# EAGLE design LOCO-Servo (EAGLE 9.5.2)

## Sheet 1 of 2
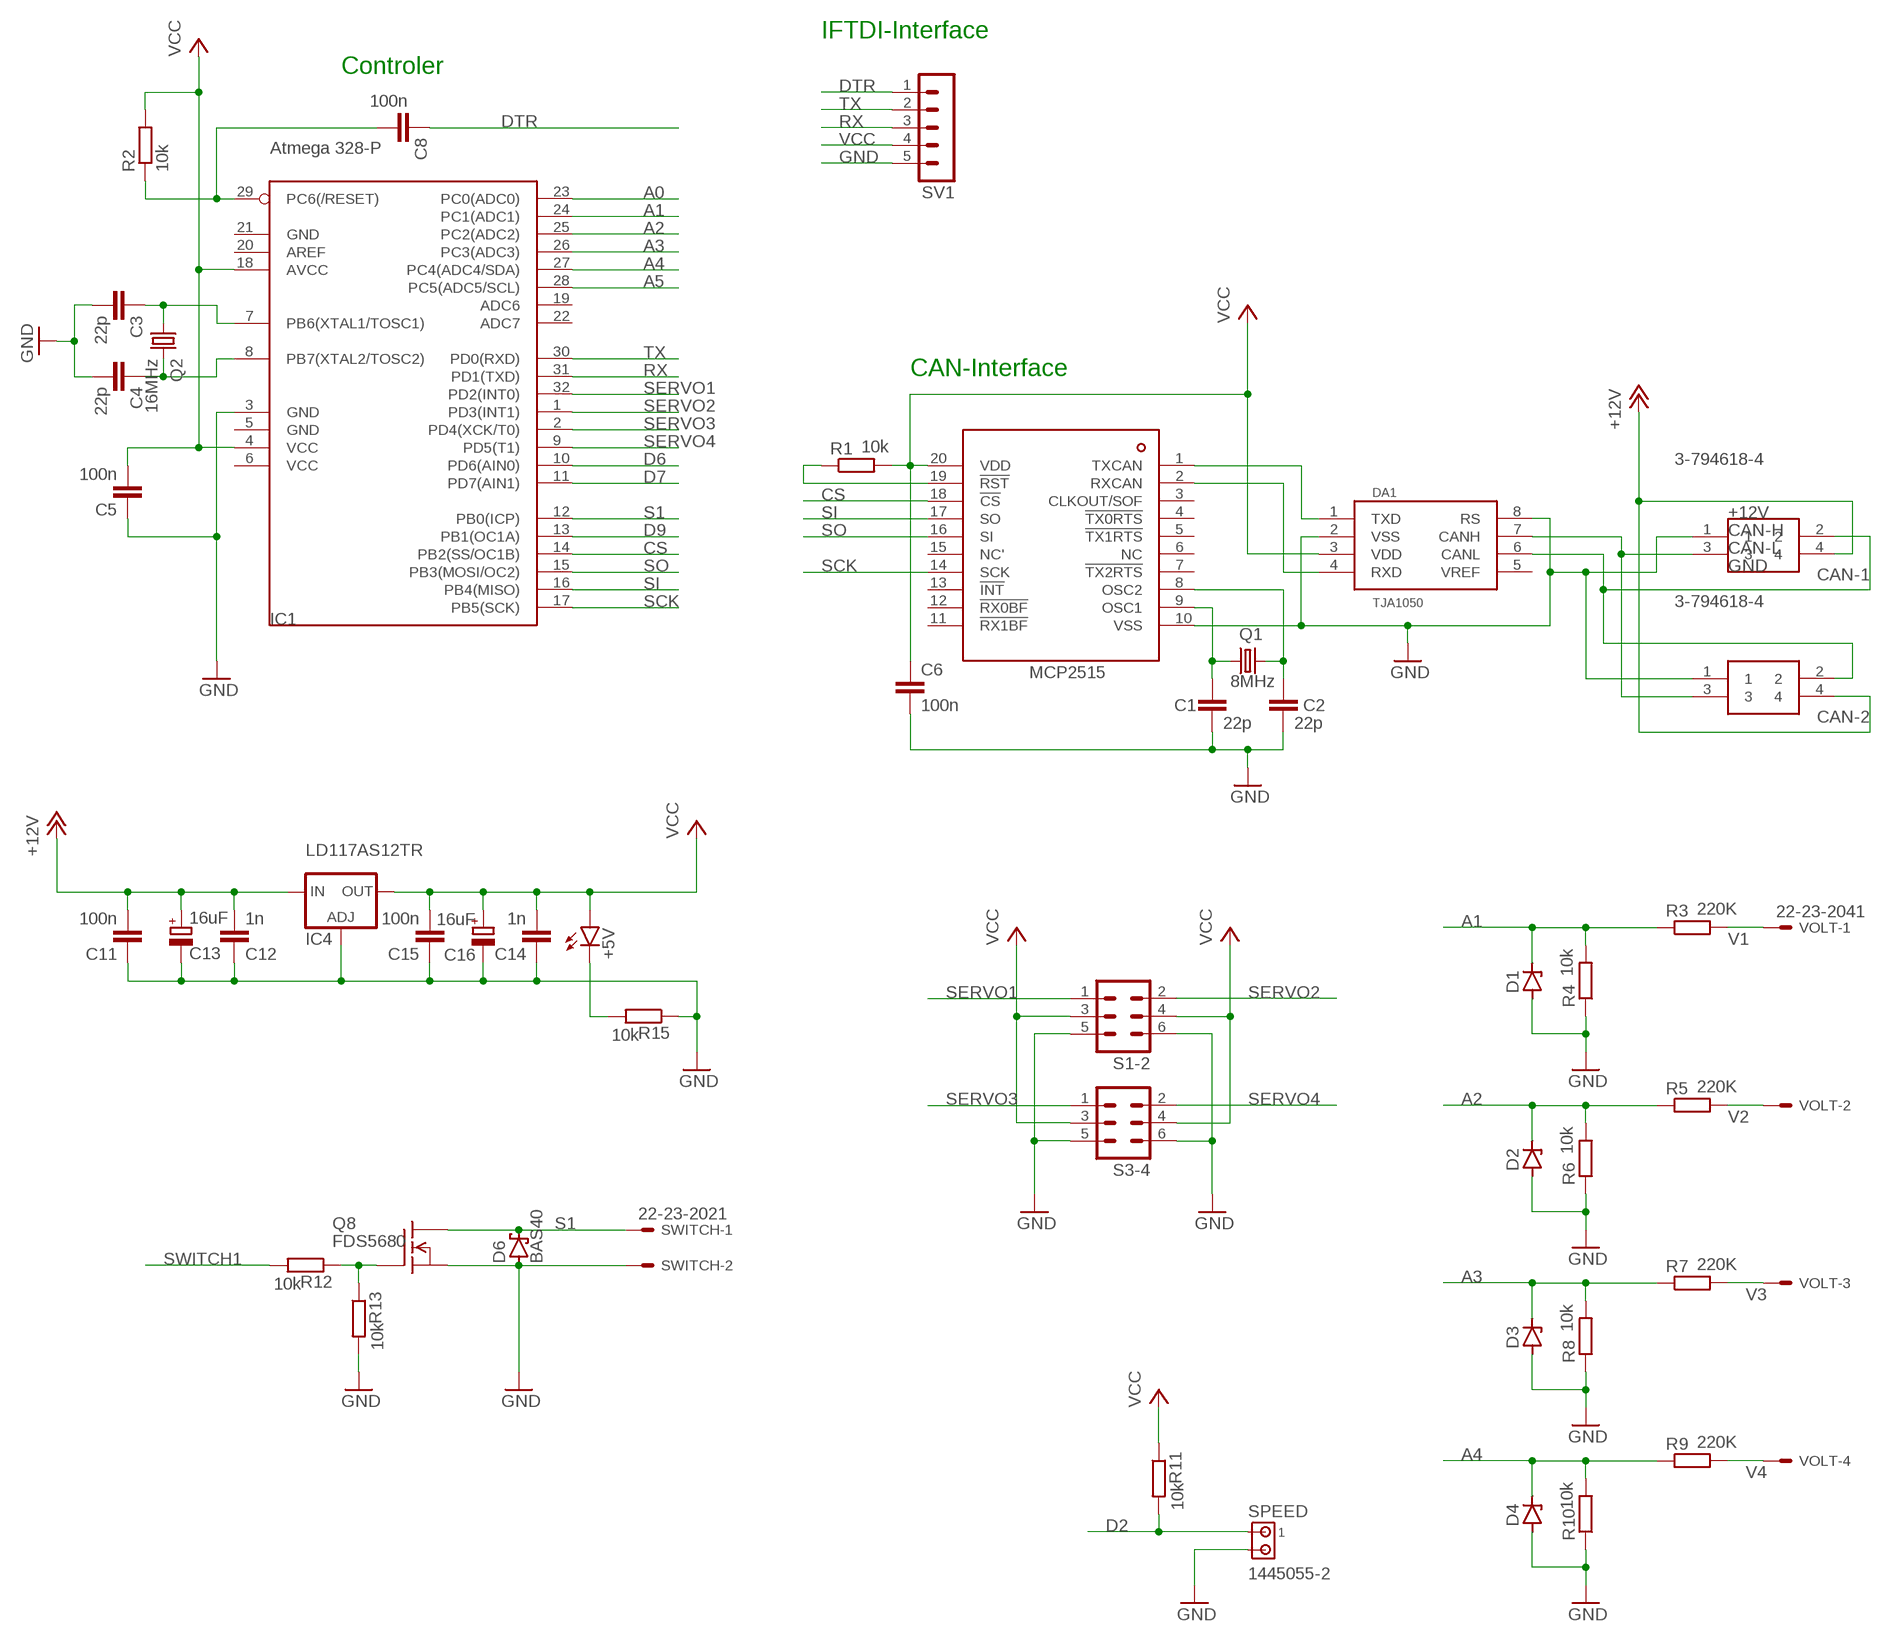
[diagram p0: schematic, sheet 1]

### Parts
+5V  LEDCHIP-LED0603  [CHIP-LED0603]
C1  22p  C-EUC0402K  [C0402K]
C2  22p  C-EUC0402K  [C0402K]
C3  22p  C-EUC0402K  [C0402K]
C4  22p  C-EUC0402K  [C0402K]
C5  100n  C-EUC0402K  [C0402K]
C6  100n  C-EUC0402K  [C0402K]
C8  100n  C-EUC0402K  [C0402K]
C11  100n  C-EUC0402K  [C0402K]
C12  1n  C-EUC0402K  [C0402K]
C13  16uF  CPOL-EUA/3216-18W  [A/3216-18W]
C14  1n  C-EUC0402K  [C0402K]
C15  100n  C-EUC0402K  [C0402K]
C16  16uF  CPOL-EUA/3216-18W  [A/3216-18W]
CAN-1  3-794618-4  [SHDRRA4W102P300_2X2_686X892X73]
CAN-2  3-794618-4  [SHDRRA4W102P300_2X2_686X892X73]
D1  ZENER-DIODESOD80C  [SOD80C]
D2  ZENER-DIODESOD80C  [SOD80C]
D3  ZENER-DIODESOD80C  [SOD80C]
D4  ZENER-DIODESOD80C  [SOD80C]
D6  BAS40  [SOT23]
DA1  TJA1050  [SO08]
IC1  Atmega 328-P  MEGA8-AI  [TQFP32-08]
IC2  MCP2515  [TSSOP20]
IC4  LD117AS12TR  [SOT223]
Q1  8MHz  CRYSTALHC49S  [HC49/S]
Q2  16MHz  CRYSTALHC49S  [HC49/S]
Q8  FDS5680  [SO-8]
R1  10k  R-EU_MELF0102W  [MINI_MELF-0102W]
R2  10k  R-EU_MELF0102W  [MINI_MELF-0102W]
R3  220K  R-EU_MELF0102W  [MINI_MELF-0102W]
R4  10k  R-EU_MELF0102W  [MINI_MELF-0102W]
R5  220K  R-EU_MELF0102W  [MINI_MELF-0102W]
R6  10k  R-EU_MELF0102W  [MINI_MELF-0102W]
R7  220K  R-EU_MELF0102W  [MINI_MELF-0102W]
R8  10k  R-EU_MELF0102W  [MINI_MELF-0102W]
R9  220K  R-EU_MELF0102W  [MINI_MELF-0102W]
R10  10k  R-EU_MELF0102W  [MINI_MELF-0102W]
R11  10k  R-EU_MELF0102W  [MINI_MELF-0102W]
R12  10k  R-EU_MELF0102W  [MINI_MELF-0102W]
R13  10k  R-EU_MELF0102W  [MINI_MELF-0102W]
R15  10k  R-EU_MELF0102W  [MINI_MELF-0102W]
S1-2  MA03-2  [MA03-2]
S3-4  MA03-2  [MA03-2]
SPEED  1445055-2  [1445055-2]
SV1  MA05-1  [MA05-1]
SWITCH  22-23-2021  [22-23-2021]
VOLT  22-23-2041  [22-23-2041]

### Nets
+12V: C11.2 C12.2 C13.+ CAN-1.4 CAN-2.4 IC4.3(IN)
A0: IC1.23(PC0(ADC0))
A1: D1.C IC1.24(PC1(ADC1)) R3.1 R4.2
A2: D2.C IC1.25(PC2(ADC2)) R5.1 R6.2
A3: D3.C IC1.26(PC3(ADC3)) R7.1 R8.2
A4: D4.C IC1.27(PC4(ADC4/SDA)) R9.1 R10.2
A5: IC1.28(PC5(ADC5/SCL))
CAN-H: CAN-1.3 CAN-2.3 DA1.7(CANH)
CAN-L: CAN-1.2 CAN-2.2 DA1.6(CANL)
CAN-OCC1: C1.1 IC2.9(OSC1) Q1.1
CAN-OCC2: C2.1 IC2.8(OSC2) Q1.2
CS: IC1.14(PB2(SS/OC1B)) IC2.18(!CS)
D2: R11.2 SPEED.1
D6: IC1.10(PD6(AIN0))
D7: IC1.11(PD7(AIN1))
D9: IC1.13(PB1(OC1A))
DTR: C8.1 SV1.1
GND: C1.2 C2.2 C3.2 C4.2 C5.1 C6.2 C11.1 C12.1 C13.- C14.1 C15.1 C16.- CAN-1.1 CAN-2.1 D1.A D2.A D3.A D4.A D6.1(A) DA1.2(VSS) DA1.8(RS) IC1.3(GND) IC2.10(VSS) IC4.1(ADJ) Q8.1(S) Q8.2(S) Q8.3(S) R4.1 R6.1 R8.1 R10.1 R13.2 R15.1 S1-2.5 S1-2.6 S3-4.5 S3-4.6 SPEED.2 SV1.5 SWITCH.2
N$6: IC2.19(!RST) R1.1
N$8: Q8.4(G) R12.1 R13.1
N$10: C3.1 IC1.7(PB6(XTAL1/TOSC1)) Q2.1
N$11: C4.1 IC1.8(PB7(XTAL2/TOSC2)) Q2.2
N$12: +5V.C R15.2
N$15: C8.2 IC1.29(PC6(/RESET)) R2.1
RX: IC1.31(PD1(TXD)) SV1.3
RXCAN: DA1.4(RXD) IC2.2(RXCAN)
S1: D6.3(C) IC1.12(PB0(ICP)) Q8.5(D) Q8.6(D) Q8.7(D) Q8.8(D) SWITCH.1
SCK: IC1.17(PB5(SCK)) IC2.14(SCK)
SERVO1: IC1.32(PD2(INT0)) S1-2.1
SERVO2: IC1.1(PD3(INT1)) S1-2.2
SERVO3: IC1.2(PD4(XCK/T0)) S3-4.1
SERVO4: IC1.9(PD5(T1)) S3-4.2
SI: IC1.16(PB4(MISO)) IC2.17(SO)
SO: IC1.15(PB3(MOSI/OC2)) IC2.16(SI)
SWITCH1: R12.2
TX: IC1.30(PD0(RXD)) SV1.2
TXCAN: DA1.1(TXD) IC2.1(TXCAN)
V1: R3.2 VOLT.1
V2: R5.2 VOLT.2
V3: R7.2 VOLT.3
V4: R9.2 VOLT.4
VCC: +5V.A C5.2 C6.1 C14.2 C15.2 C16.+ DA1.3(VDD) IC1.4(VCC) IC1.18(AVCC) IC2.20(VDD) IC4.4(OUT) R1.2 R2.2 R11.1 S1-2.3 S1-2.4 S3-4.3 S3-4.4 SV1.4
Unconnected: DA1.5(VREF) IC1.19(ADC6) IC1.20(AREF) IC1.22(ADC7) IC2.3(CLKOUT/SOF) IC2.4(!TX0RTS) IC2.5(!TX1RTS) IC2.6(NC) IC2.7(!TX2RTS) IC2.11(!RX1BF) IC2.12(!RX0BF) IC2.13(!INT) IC2.15(NC')

### Notes on the sheet
- IFTDI-Interface
- Controler
- CAN-Interface

## Sheet 2 of 2

## Power pins joined to a net without a drawn wire
GND: IC1.5(GND) IC1.21(GND)
VCC: IC1.6(VCC)

## Library data of the parts
+5V = led:LED: LED OSRAM: - CHIPLED LG R971, LG N971, LY N971, LG Q971, LY Q971, LO R971, LY R971 LH N974, LH R974 LS Q976, LO Q976, LY Q976 LO Q996 - Hyper CHIPLED LW Q18S LB Q993, LB Q99A, LB R99A - SideLED LS A670, LO A670, LY A670, LG A670, LP A670 LB A673, LV A673, LT A673, LW A673 LH A674 LY A675 LS A676, LA A676, LO A676, LY A676, LW A676 LS A679, LY A679, LG A679 - Hyper Micro SIDELED® LS Y876, LA Y876, LO Y876, LY Y876 LT Y87S - SmartLED LW L88C, LW L88S LB L89C, LB L89S, LG L890 LS L89K, LO L89K, LY L89K LS L896, LA L896, LO L896, LY L896 - TOPLED LS T670, LO T670, LY T670, LG T670, LP T670 LSG T670, LSP T670, LSY T670, LOP T670, LYG T670 LG T671, LOG T671, LSG T671 LB T673, LV T673, LT T673, LW T673 LH T674 LS T676, LA T676, LO T676, LY T676, LB T676, LH T676, LSB T676, LW T676 LB T67C, LV T67C, LT T67C, LS T67K, LO T67K, LY T67K, LW E67C LS E67B, LA E67B, LO E67B, LY E67B, LB E67C, LV E67C, LT E67C LW T67C LS T679, LY T679, LG T679 LS T770, LO T770, LY T770, LG T770, LP T770 LB T773, LV T773, LT T773, LW T773 LH T774 LS E675, LA E675, LY E675, LS T675 LS T776, LA T776, LO T776, LY T776, LB T776 LHGB T686 LT T68C, LB T68C - Hyper Mini TOPLED® LB M676 - Mini TOPLED Santana® LG M470 LS M47K, LO M47K, LY M47K Source: http://www.osram.convergy.de LUXEON: - LUMILED® LXK2-PW12-R00, LXK2-PW12-S00, LXK2-PW14-U00, LXK2-PW14-V00 LXK2-PM12-R00, LXK2-PM12-S00, LXK2-PM14-U00 LXK2-PE12-Q00, LXK2-PE12-R00, LXK2-PE12-S00, LXK2-PE14-T00, LXK2-PE14-U00 LXK2-PB12-K00, LXK2-PB12-L00, LXK2-PB12-M00, LXK2-PB14-N00, LXK2-PB14-P00, LXK2-PB14-Q00 LXK2-PR12-L00, LXK2-PR12-M00, LXK2-PR14-Q00, LXK2-PR14-R00 LXK2-PD12-Q00, LXK2-PD12-R00, LXK2-PD12-S00 LXK2-PH12-R00, LXK2-PH12-S00 LXK2-PL12-P00, LXK2-PL12-Q00, LXK2-PL12-R00 Source: www.luxeon.com KINGBRIGHT: KA-3528ASYC Source: www.kingbright.com
C1-C6 C8 C11 C12 C14 C15 = rcl:C-EU: CAPACITOR, European symbol; SPICEPREFIX: C
C13 C16 = rcl:CPOL-EU: POLARIZED CAPACITOR, European symbol; SPICEPREFIX: C
CAN-1 CAN-2 = SamacSys_Parts:3-794618-4: 4 way 2 row r/a header Mate-N-Lok Source: Datasheet <https://rs.componentsearchengine.com/Datasheets/2/3-794618-4.pdf>; DESCRIPTION: 4 way 2 row r/a header Mate-N-Lok; HEIGHT: 7.37mm; MANUFACTURER_NAME: TE Connectivity; MANUFACTURER_PART_NUMBER: 3-794618-4
D1-D4 = diode:ZENER-DIODE: Z-Diode
D6 = diode:BAS40: Silicon Schottky Diodes General-purpose diode for high-speed switching
DA1 = TJA1050:TJA1050: High speed CAN transceiver Input levels compatible with 3.3 V and 5 V devices 5V supply
IC1 = atmel:MEGA8: MICROCONTROLLER 8 Kbytes FLASH, 1 kbytes SRAM, 512 bytes EEPROM, USART, 6-channel 10 bit ADC, 2-channel 8 bit ADC Pin compatible with Atmega48, ATMega88, ATMega168 Source: avr.lbr; MPN: ATMEGA8-16AU; OC_FARNELL: 9171371; OC_NEWARK: 73M8863
IC2 = mcp2514:MCP2515: Microchip Technology’s MCP2515 is a stand-alone Controller Area Network (CAN) controller that implements the CAN specification, version 2.0B. It is capable of transmitting and receiving both standard and extended data and remote frames. The MCP2515 has two acceptance masks and six acceptance filters that are used to filter out unwanted messages, thereby reducing the host MCUs overhead. The MCP2515 interfaces with microcontrollers (MCUs) via an industry standard Serial Peripheral Interface (SPI).
IC4 = v-reg:LD117A?*: Low drop fixed and adjustable positive voltage regulators 1 A Source: http://www.st.com/stonline/products/literature/ds/7194/ld1117axx.pdf
Q1 Q2 = crystal:CRYSTAL: CRYSTAL; OC_FARNELL: 1667008; OC_NEWARK: unknown
Q8 = transistor-fet:FDS5680: 60V N-Channel PowerTrench TM MOSFET FAIRCHILD FDS5680.pdf
R1-R13 R15 = rcl:R-EU_: RESISTOR, European symbol; SPICEPREFIX: R
S1-2 S3-4 = con-lstb:MA03-2: PIN HEADER; OC_FARNELL: unknown; OC_NEWARK: unknown
SPEED = con-amp:1445055-2: Micro MATE-N-LOK Connectors grid 1.5 mm Source: ENG_CD_1445055_A.pdf
SV1 = con-lstb:MA05-1: PIN HEADER; OC_FARNELL: unknown; OC_NEWARK: unknown
SWITCH = con-molex:22-23-2021: .100" (2.54mm) Center Header - 2 Pin; MF: MOLEX; MPN: 22-23-2021; OC_FARNELL: 1462926; OC_NEWARK: 25C3832
VOLT = con-molex:22-23-2041: .100" (2.54mm) Center Header - 4 Pin; MF: MOLEX; MPN: 22-23-2041; OC_FARNELL: 1462920; OC_NEWARK: 38C0355

## Board
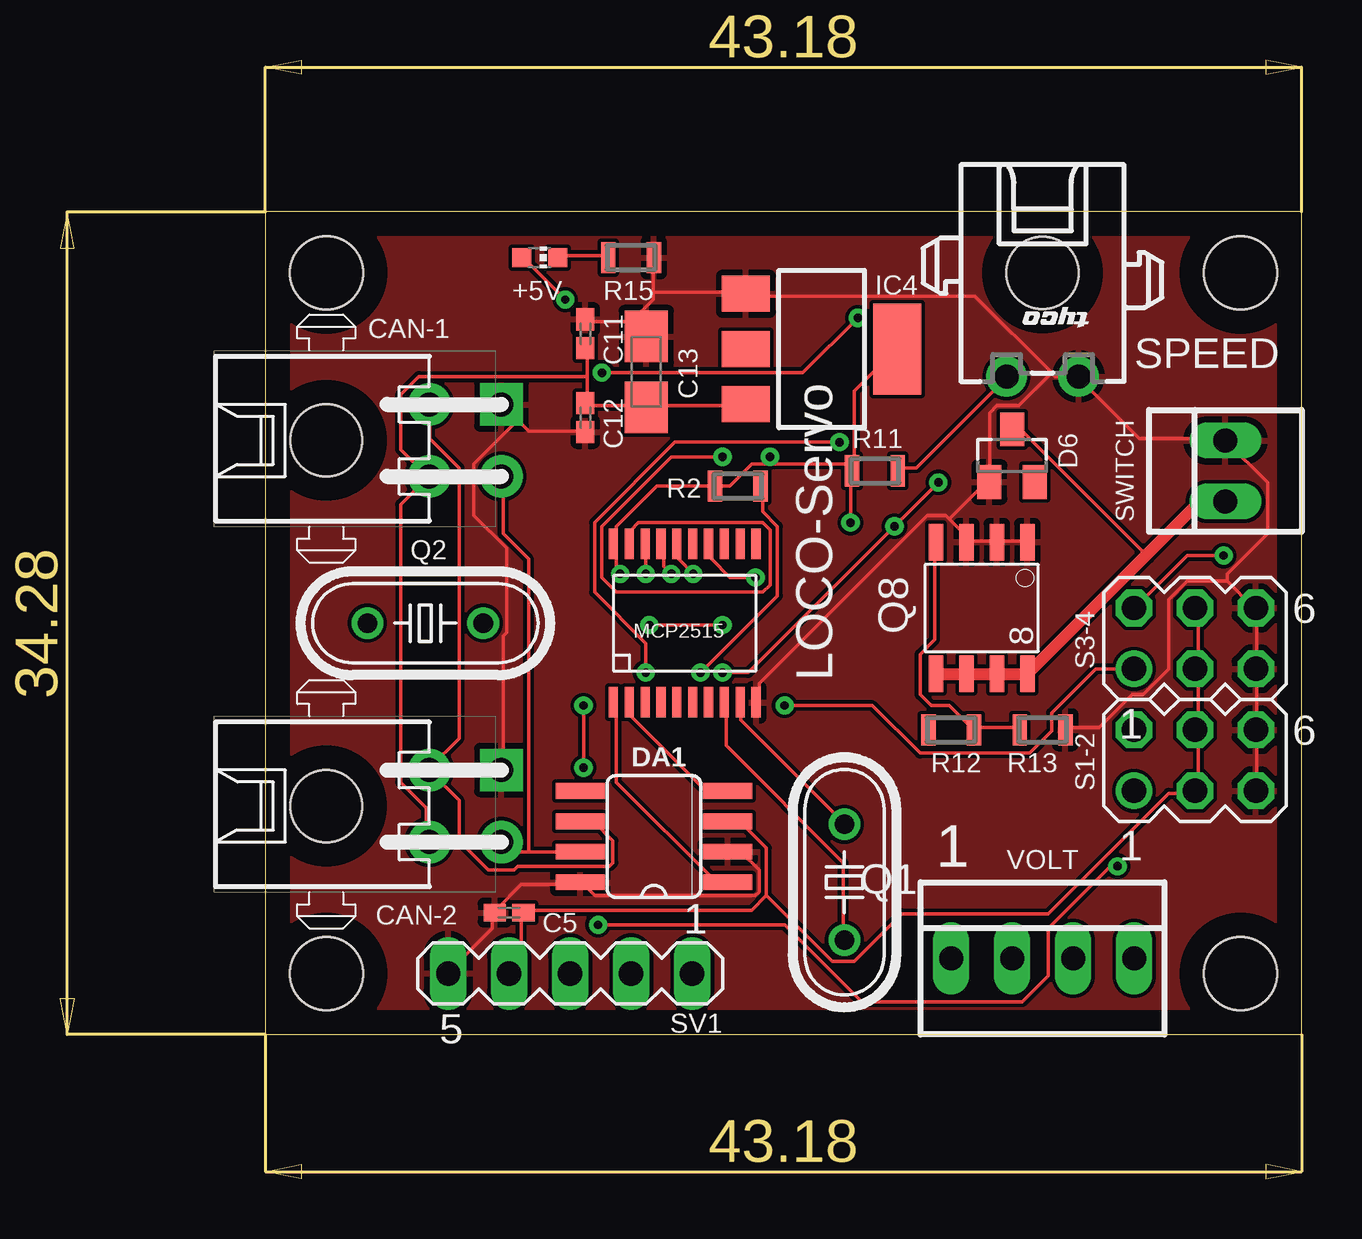
[diagram p1: board, top side]
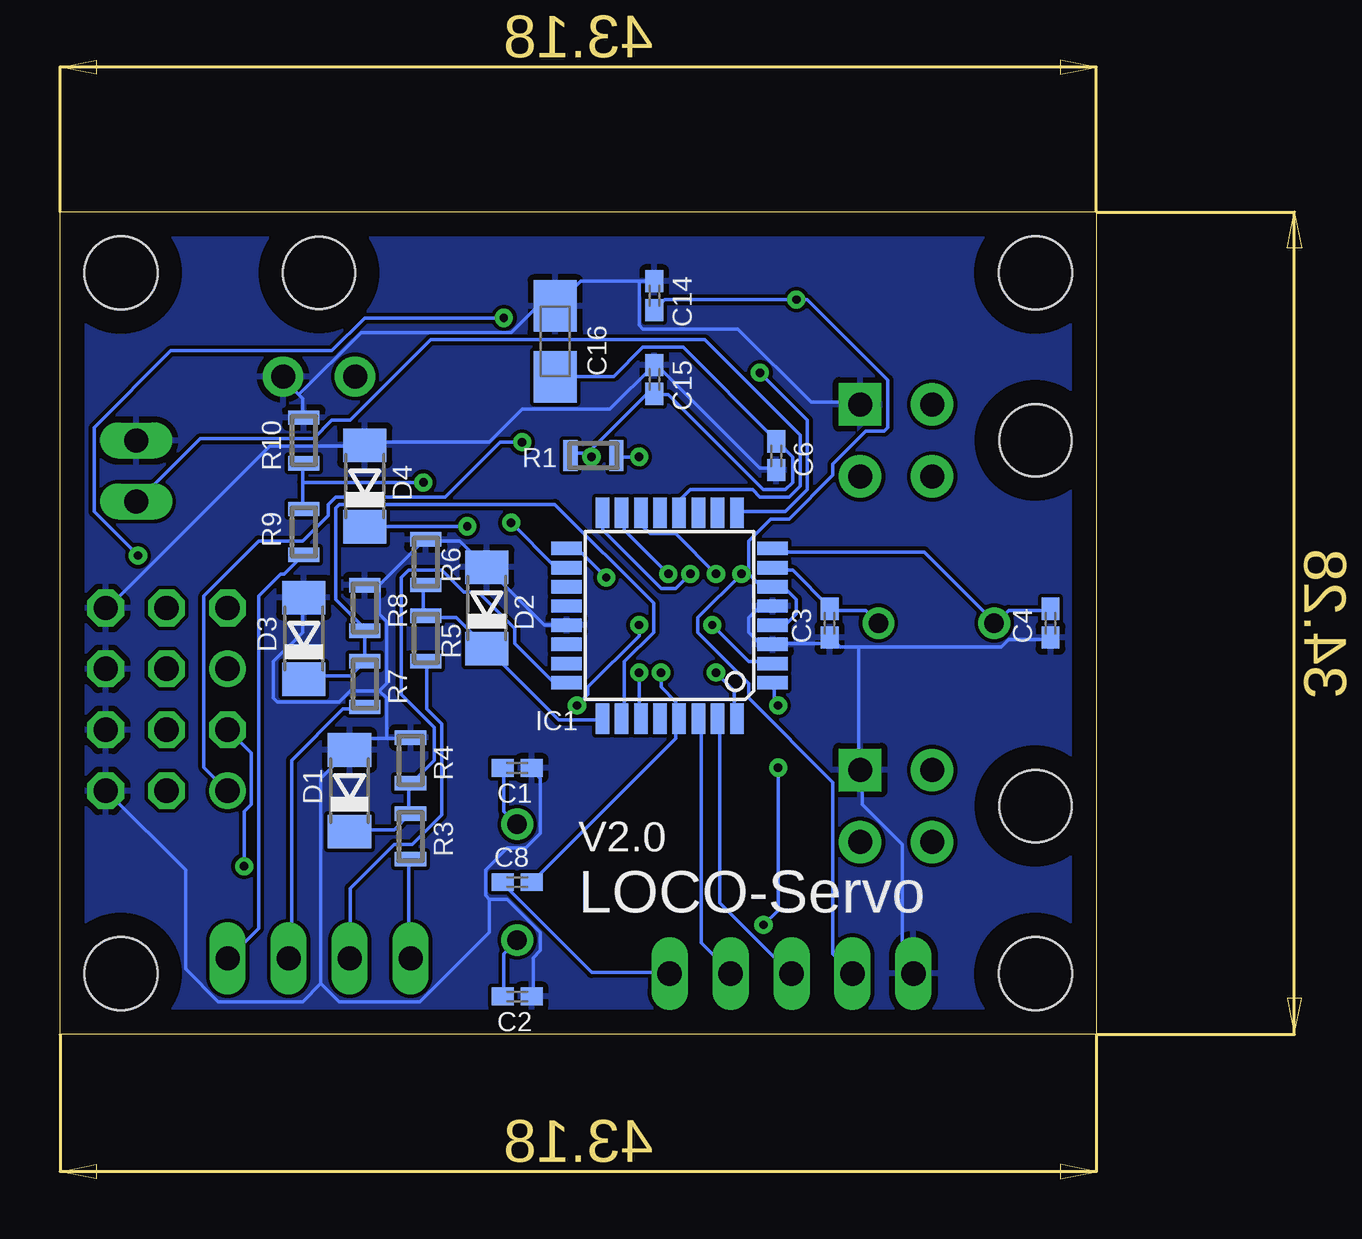
[diagram p2: board, bottom side, seen from below]

Size 43.18 x 34.29 mm. Coordinates in mm from the lower left corner, seen from the top.
Outline: 0,0 43.18,0 43.18,34.29 0,34.29 0,0
Copper layers (1*16): Top 0.035mm / dielectric 1.5mm / Bottom 0.035mm
Design rules "default": minimum track width 6mil, minimum drill 0.35mm, track to track 6mil, track to pad 6mil, pad to pad 6mil, via to via 6mil, smd to smd 6mil, copper to edge 40mil, drill to drill 6mil, minimum pad ring 10mil, minimum via ring 8mil, stop-mask expansion 4mil, vias tented up to drill 0mil, thermal gap 10mil
Holes 3.05 mm at 2.54,2.54 2.54,31.75 40.64,2.54 40.64,31.75

### Footprints (pad centres in the part's own frame; a part is rotated, then mirrored left to right if it is on the bottom)
CHIP-LED0603 = smd 0.8 x 0.8: A 0,-0.75; C 0,0.75
C0402K = smd 0.925 x 0.74: 1 -0.6,0; 2 0.6,0
A/3216-18W = smd 2.15 x 1.8: + 1.475,0; - -1.475,0
SHDRRA4W102P300_2X2_686X892X73 = drill 1 pad 1.778 square: 1 1.5,-7.3 | drill 1 pad 1.778: 2 1.5,-4.3; 3 -1.5,-7.3; 4 -1.5,-4.3 | hole 3: 0,0
SOD80C = smd 1.4 x 1.8: A 1.7,0; C -1.7,0
SOT23 = smd 1 x 1.4: 1 -0.95,-1.1; 2 0.95,-1.1; 3 0,1.1
SO08 = smd 0.66 x 2.032: 1 -1.905,-3.073; 2 -0.635,-3.073; 3 0.635,-3.073; 4 1.905,-3.073; 5 1.905,3.073; 6 0.635,3.073; 7 -0.635,3.073; 8 -1.905,3.073
TQFP32-08 = smd 1.27 x 0.559: 1 -4.293,2.8; 2 -4.293,2; 3 -4.293,1.2; 4 -4.293,0.4; 5 -4.293,-0.4; 6 -4.293,-1.2; 7 -4.293,-2; 8 -4.293,-2.8; 17 4.293,-2.8; 18 4.293,-2; 19 4.293,-1.2; 20 4.293,-0.4; 21 4.293,0.4; 22 4.293,1.2; 23 4.293,2; 24 4.293,2.8 | smd 0.559 x 1.27: 9 -2.8,-4.293; 10 -2,-4.293; 11 -1.2,-4.293; 12 -0.4,-4.293; 13 0.4,-4.293; 14 1.2,-4.293; 15 2,-4.293; 16 2.8,-4.293; 25 2.8,4.293; 26 2,4.293; 27 1.2,4.293; 28 0.4,4.293; 29 -0.4,4.293; 30 -1.2,4.293; 31 -2,4.293; 32 -2.8,4.293
TSSOP20 = smd 1.27 x 0.381: 1 -3.302,2.642; 2 -3.302,1.981; 3 -3.302,1.321; 4 -3.302,0.66; 5 -3.302,0; 6 -3.302,-0.66; 7 -3.302,-1.321; 8 -3.302,-1.981; 9 -3.302,-2.642; 10 -3.302,-3.302; 11 3.302,-3.302; 12 3.302,-2.642; 13 3.302,-1.981; 14 3.302,-1.321; 15 3.302,-0.66; 16 3.302,0; 17 3.302,0.66; 18 3.302,1.321; 19 3.302,1.981; 20 3.302,2.642
SOT223 = smd 1.5 x 2: 1 -2.3,-3.15; 2 0,-3.15; 3 2.3,-3.15 | smd 3.8 x 2: 4 0,3.15
HC49/S = drill 0.813: 1 -2.413,0; 2 2.413,0
SO-8 = smd 1.524 x 0.61: 1 -2.743,1.905; 2 -2.743,0.635; 3 -2.743,-0.635; 4 -2.743,-1.905; 5 2.743,-1.905; 6 2.743,-0.635; 7 2.743,0.635; 8 2.743,1.905
MINI_MELF-0102W = smd 0.6 x 1.3: 1 -0.95,0; 2 0.95,0
MA03-2 = drill 1.016: 1 -2.54,-1.27 | drill 1.016 octagon: 2 -2.54,1.27; 3 0,-1.27; 4 0,1.27; 5 2.54,-1.27; 6 2.54,1.27
1445055-2 = drill 1 pad 1.676: 1 1.5,4.32; 2 -1.5,4.32 | hole 3: 0,0
MA05-1 = drill 1.016 long: 1 -5.08,0; 2 -2.54,0; 3 0,0; 4 2.54,0; 5 5.08,0
22-23-2021 = drill 1 long: 1 -1.27,0; 2 1.27,0
22-23-2041 = drill 1 long: 1 -3.81,0; 2 -1.27,0; 3 1.27,0; 4 3.81,0

### Placement (x,y rotation side)
+5V  11.43,32.38 270 top
C1  24.13,11.11 0 bottom
C2  24.13,1.59 0 bottom
C3  11.11,17.14 270 bottom
C4  1.91,17.14 270 bottom
C5  10.16,5.08 0 top
C6  13.34,24.13 270 bottom
C8  24.13,6.35 0 bottom
C11  13.34,29.21 270 top
C12  13.34,25.72 90 top
C13  15.88,27.62 270 top
C14  18.41,30.8 270 bottom
C15  18.41,27.3 270 bottom
C16  22.54,28.89 270 bottom
CAN-1  2.54,24.77 90 top
CAN-2  2.54,9.53 90 top
D1  31.11,10.16 90 bottom
D2  25.4,17.78 90 bottom
D3  33.02,16.51 90 bottom
D4  30.48,22.86 90 bottom
D6  31.11,24.13 0 top
DA1  16.19,8.26 90 top
IC1  17.78,17.46 180 bottom
IC2  17.14,17.14 90 top
IC4  23.18,28.57 270 top
Q1  24.13,6.35 270 top
Q2  6.67,17.14 180 top
Q8  29.84,17.78 270 top
R1  20.95,24.13 180 bottom
R2  19.68,22.86 180 top
R3  28.57,8.26 270 bottom
R4  28.57,11.43 270 bottom
R5  27.94,16.51 270 bottom
R6  27.94,19.68 270 bottom
R7  30.48,14.61 270 bottom
R8  30.48,17.78 270 bottom
R9  33.02,20.95 270 bottom
R10  33.02,24.77 270 bottom
R11  25.4,23.5 0 top
R12  28.57,12.7 180 top
R13  32.38,12.7 0 top
R15  15.24,32.38 180 top
S1-2  38.73,11.43 0 top
S3-4  38.73,16.51 0 top
SPEED  32.38,31.75 180 top
SV1  12.7,2.54 180 top
SWITCH  40.01,23.5 90 top
VOLT  32.38,3.17 0 top

### Tracks (layer width: path | path; a pad name or v marks a point on that pad's centre or on a via)
+12V
  Top 0.152: 13.41,27.43 13.41,28.5 C11.2 | 13.41,27.43 13.41,26.36 C12.2 13.41,26.21 15.85,26.21 C13.+ 16,26.21 19.96,26.21 IC4.3 | CAN-2.4 6.71,8.08 6.71,9.45 5.64,10.52 5.64,22.1 6.71,23.16 CAN-1.4 6.71,23.32 5.64,24.38 5.64,26.67 6.4,27.43 13.41,27.43
A1
  Bottom 0.152: IC1.24 22.1,14.78 22.71,14.78 24.23,16.31 24.23,16.92 25.76,18.44 26.36,18.44 27.28,19.36 28.65,19.36 28.96,19.05 28.96,14.17 27.58,12.8 27.58,11.43 28.5,10.52 R4.2 28.65,10.36 28.65,9.3 R3.1 28.65,9.14 29.26,8.53 31.09,8.53 D1.C
A2
  Bottom 0.152: R6.2 28.04,18.59 28.04,17.53 R5.1 27.89,17.37 26.67,17.37 25.45,16.15 D2.C 25.3,16 22.4,13.11 20.73,13.11 IC1.25
A3
  Bottom 0.152: IC1.26 19.66,13.26 19.66,15.54 18.44,16.76 18.44,17.98 22.55,22.1 31.55,22.1 31.7,21.95 31.7,18.14 30.48,16.92 R8.2 R7.1 31.09,14.94 32.92,14.94 D3.C
A4  (via drill 0.35)
  Top 0.152: v19.05,15.09 20.12,15.09 v26.21,21.18 v28.04,23.01
  Bottom 0.152: 33.07,23.01 33.07,23.77 R10.2 | 33.07,23.01 33.07,21.95 R9.1 | v19.05,15.09 19.05,13.26 IC1.27 | v26.21,21.18 30.48,21.18 D4.C | v28.04,23.01 33.07,23.01
CAN-H
  Top 0.152: 10.97,7.62 10.21,7.62 9.91,7.92 CAN-2.3 | 10.97,7.62 DA1.7 | 10.97,7.62 10.97,19.81 9.91,20.88 9.91,23.16 CAN-1.3
CAN-L
  Top 0.152: DA1.6 13.26,8.84 13.72,8.84 14.48,8.08 14.48,7.16 14.33,7.01 10.52,7.01 10.36,6.86 9.3,6.86 8.08,8.08 8.08,9.75 6.86,10.97 CAN-2.2 6.86,11.12 8.08,12.34 8.08,23.62 6.86,24.84 6.86,26.21 CAN-1.2
CAN-OCC1
  Top 0.152: IC2.9 19.81,13.72 19.81,13.11 24.08,8.84 Q1.1
  Bottom 0.152: C1.1 24.69,10.97 24.69,9.3 24.23,8.84 Q1.1
CAN-OCC2
  Top 0.152: IC2.8 19.2,13.72 19.2,12.04 24.08,7.16 24.08,3.96 Q1.2
  Bottom 0.152: C2.1 24.69,1.68 24.69,3.35 24.23,3.81 Q1.2
CS  (via drill 0.35)
  Top 0.152: v15.85,19.2 15.85,20.42 IC2.18
  Bottom 0.152: v15.85,19.2 17.53,20.88 18.59,20.88 18.9,21.18 18.9,21.64 IC1.14
D2
  Top 0.152: R11.2 26.36,23.62 27.13,23.62 30.79,27.28 SPEED.1
DTR
  Bottom 0.152: C8.1 24.69,6.25 21.03,2.59 17.83,2.59 SV1.1
GND
  Top 0.152: SV1.5 7.62,2.59 9.45,4.42 9.45,5.03 C5.1 9.6,5.18 10.67,6.25 13.11,6.25 DA1.8 13.26,6.25 13.72,5.79 20.42,5.79 20.57,5.94 20.57,6.86 19.81,7.62 DA1.2 | 28.5,21.49 29.11,20.88 29.11,20.57 Q8.3 29.26,20.57 30.48,20.57 | 28.5,21.49 28.35,21.64 27.58,21.64 20.57,14.63 20.57,13.87 IC2.10 | 28.5,21.49 30.02,23.01 D6.1 30.18,23.16 30.18,25.91 30.48,26.21 31.39,26.21 32.77,27.58 | 30.48,20.57 31.7,20.57 Q8.1 | 30.48,20.57 Q8.2 | S1-2.5 41.3,10.21 41.3,12.65 S1-2.6 41.3,12.8 41.3,15.24 | 40.08,18.9 38.41,18.9 37.64,18.14 37.64,15.24 36.58,14.17 36.12,14.17 34.75,12.8 33.38,12.8 R13.2 | 40.08,18.9 41.15,17.83 S3-4.6 41.3,17.68 41.3,15.24 | 41.3,15.24 S3-4.5 | 15.24,29.72 13.41,29.72 C11.1 | 15.24,29.72 15.85,29.11 C13.- 15.24,29.72 | 16.15,30.94 16.15,30.63 15.24,29.72 | 16.15,30.94 16.15,32.31 R15.1 | 16.15,30.94 19.96,30.94 IC4.1 20.12,30.79 29.57,30.79 32.77,27.58 | 10.52,25.6 9.91,26.21 CAN-1.1 10.52,25.6 | 10.52,25.6 10.97,25.15 13.26,25.15 C12.1 | 32.77,27.58 32.92,27.43 33.83,27.43 SPEED.2 33.98,27.28 36.42,24.84 39.93,24.84 SWITCH.2 41.76,23.01 41.76,20.88 40.08,19.2 40.08,18.9 | 10.52,25.6 8.69,23.77 8.69,21.64 10.06,20.27 10.06,16.76 9.91,16.61 9.91,11.12 CAN-2.1
  Bottom 0.152: 9.91,16.15 10.67,16.15 10.97,16.46 C3.2 11.12,16.46 11.28,16.31 13.41,16.31 IC1.3 13.56,16.31 14.02,16.31 14.48,16.76 14.48,17.37 14.02,17.83 13.56,17.83 IC1.5 | 9.91,16.15 3.96,16.15 3.66,16.46 1.98,16.46 C4.2 | 9.91,16.15 9.91,11.12 CAN-2.1 9.75,10.97 9.75,9.6 8.08,7.92 8.08,3.05 7.62,2.59 SV1.5 | IC1.21 22.1,17.07 23.01,17.07 25.3,19.36 D2.A 25.45,19.51 26.52,20.57 27.89,20.57 R6.1 28.04,20.57 29.87,18.75 | 29.87,18.75 30.48,18.75 R8.1 29.87,18.75 | 25.3,5.64 24.54,5.64 23.16,4.27 23.16,3.5 23.47,3.2 23.47,1.68 C2.2 | 25.3,5.64 25.45,5.79 25.45,6.86 24.54,7.77 23.77,7.77 23.16,8.38 23.16,10.67 23.47,10.97 C1.2 | 29.57,12.34 30.63,12.34 31.09,11.89 D1.A 31.24,11.73 32.31,10.67 32.31,2.13 | 29.57,12.34 28.65,12.34 R4.1 | 29.87,14.33 31.09,14.33 31.55,13.87 34.14,13.87 34.29,14.02 34.29,15.54 33.07,16.76 33.07,18.14 D3.A | 29.87,14.33 29.57,14.02 29.57,12.34 | 25.3,5.64 25.3,4.27 28.19,1.37 31.55,1.37 32.31,2.13 | 29.87,18.75 29.87,17.53 29.57,17.22 29.57,14.63 29.87,14.33 | C6.2 13.41,23.62 14.02,23.62 18.29,27.89 C15.1 18.44,27.89 20.27,26.06 23.93,26.06 25.3,24.69 30.48,24.69 D4.A 30.48,24.54 34.44,24.54 41.15,17.83 S3-4.6 | 19.05,31.39 21.49,31.39 22.4,30.48 C16.- 22.55,30.33 23.32,30.33 24.38,29.26 30.63,29.26 33.22,26.67 | 19.05,31.39 18.44,31.39 C14.1 | 33.22,26.67 33.83,27.28 SPEED.2 | 33.22,26.67 33.07,26.52 33.07,25.76 R10.1 | 19.05,31.39 19.05,29.57 18.9,29.41 14.94,29.41 11.89,26.36 9.91,26.36 CAN-1.1 | 32.31,2.13 33.07,1.37 36.58,1.37 37.95,2.74 37.95,6.86 41.15,10.06 S1-2.5
  pour Top: 0,34.29 43.18,34.29 43.18,0 0,0
  pour Bottom: 0,34.29 43.18,34.29 43.18,0 0,0
N$6  (via drill 0.35)
  Top 0.152: v19.05,24.08 16.92,24.08 14.02,21.18 14.02,19.05 14.63,18.44 20.73,18.44 21.03,18.75 21.03,21.03 20.73,21.34 15.54,21.34 15.24,21.03 15.24,20.57 IC2.19
  Bottom 0.152: v19.05,24.08 19.96,24.08 R1.1
N$8
  Top 0.152: R13.1 31.39,12.8 29.57,12.8 R12.1 29.41,12.8 28.5,13.72 27.74,13.72 27.28,14.17 27.28,15.85 27.89,16.46 27.89,20.42 Q8.4
N$10
  Bottom 0.152: Q2.1 9.14,17.22 9.6,17.68 10.97,17.68 C3.1 11.12,17.83 12.65,19.36 13.41,19.36 IC1.7
N$11
  Bottom 0.152: C4.1 1.98,17.68 3.66,17.68 4.12,17.22 Q2.2 4.27,17.22 7.16,20.12 13.41,20.12 IC1.8
N$12
  Top 0.152: +5V.C 12.19,32.46 14.17,32.46 R15.2
N$15  (via drill 0.35)
  Top 0.152: v18.14,15.09 21.34,18.29 21.34,21.18 20.73,21.79 20.73,22.86 R2.1
  Bottom 0.152: C8.2 23.47,6.4 17.53,12.34 17.53,13.11 IC1.29 17.53,13.26 17.53,13.87 18.14,14.48 v18.14,15.09
RX
  Bottom 0.152: IC1.31 15.7,13.11 15.7,5.49 12.8,2.59 SV1.3
RXCAN
  Top 0.152: IC2.2 15.24,13.72 15.24,13.26 18.29,10.21 19.2,10.21 DA1.4
S1
  Top 0.152: 36.7,19.99 31.55,25.15 31.24,25.15 D6.3
  Top 0.508: Q8.5 Q8.6 Q8.7 Q8.8 36.7,19.99 38.94,22.23 SWITCH.1
  Bottom 0.152: IC1.12 17.37,21.79 17.37,22.25 16.92,22.71 14.33,22.71 14.02,22.4 12.8,22.4 12.34,22.86 12.34,24.99 16.31,28.96 27.74,28.96 31.09,25.6 31.85,25.6 32.61,24.84 37.34,24.84 39.93,22.25 SWITCH.1
SCK  (via drill 0.35)
  Top 0.152: v20.42,19.05 19.36,19.05 18.59,19.81 18.59,20.42 IC2.14
  Bottom 0.152: v20.42,19.05 21.49,20.12 21.95,20.12 IC1.17
SERVO1  (via drill 0.35)
  Top 0.152: v15.85,15.09 15.85,16.31 13.72,18.44 13.72,21.34 17.07,24.69 v23.93,24.69
  Bottom 0.152: v15.85,15.09 15.09,14.33 15.09,13.26 IC1.32 | v23.93,24.69 24.84,24.69 27.13,22.4 31.7,22.4 32,22.1 32,21.64 33.07,20.57 34.9,20.57 37.19,18.29 37.19,11.12 36.27,10.21 S1-2.1
SERVO2  (via drill 0.35)
  Top 0.152: v13.26,11.12 v13.26,13.72 | v13.87,4.57 21.64,4.57 24.84,1.37 31.55,1.37 32.61,2.44 32.61,4.42 35.2,7.01 v35.51,7.01
  Bottom 0.152: v13.26,13.72 13.41,13.87 13.41,14.63 IC1.1 | v13.26,11.12 13.26,5.18 v13.87,4.57 | v35.51,7.01 35.51,9.3 35.2,9.6 35.2,11.73 36.12,12.65 S1-2.2
SERVO3  (via drill 0.35)
  Top 0.152: v19.05,17.07 v16,17.07 | v21.64,13.72 25.3,13.72 27.28,11.73 31.85,11.73 32.77,12.65 32.77,13.41 34.59,15.24 S3-4.1
  Bottom 0.152: v16,17.07 14.48,15.54 13.56,15.54 IC1.2 | v19.05,17.07 19.05,16.61 21.18,14.48 21.18,14.17 v21.64,13.72
SERVO4  (via drill 0.35)
  Top 0.152: v14.02,27.58 22.4,27.58 v24.69,29.87 | v39.93,19.96 38.41,19.96 36.27,17.83 S3-4.2
  Bottom 0.152: v14.02,27.58 12.04,25.6 12.04,22.71 12.95,21.79 14.94,21.79 IC1.9 | v24.69,29.87 30.48,29.87 31.85,28.5 38.56,28.5 41.76,25.3 41.76,21.79 v39.93,19.96
SI  (via drill 0.35)
  Top 0.152: v16.92,19.2 16.61,19.51 16.61,20.42 IC2.17
  Bottom 0.152: v16.92,19.2 17.53,18.59 18.14,18.59 20.57,21.03 20.57,21.64 IC1.16
SO  (via drill 0.35)
  Top 0.152: v17.83,19.2 17.22,19.81 17.22,20.42 IC2.16
  Bottom 0.152: v17.83,19.2 19.66,21.03 19.66,21.64 IC1.15
TX
  Bottom 0.152: IC1.30 16.46,13.11 16.46,3.81 15.24,2.59 SV1.2
TXCAN
  Top 0.152: IC2.1 14.63,13.72 14.63,10.52 18.75,6.4 19.2,6.4 DA1.1
V1
  Bottom 0.152: R3.2 28.65,7.16 28.65,3.2 VOLT.1
V2
  Bottom 0.152: R5.2 27.89,15.54 27.89,13.56 27.28,12.95 27.28,9.14 28.5,7.92 29.26,7.92 31.09,6.1 31.09,3.2 VOLT.2
V3
  Bottom 0.152: R7.2 30.48,13.56 31.39,13.56 33.53,11.43 33.53,3.2 VOLT.3
V4
  Bottom 0.152: R9.2 33.07,19.96 33.83,19.2 33.98,19.2 34.9,18.29 34.9,4.42 36.12,3.2 VOLT.4
VCC  (via drill 0.35)
  Top 0.152: v24.38,21.34 24.38,23.47 R11.1 | 24.54,23.77 24.54,26.82 26.21,28.5 IC4.4 | 24.54,23.77 24.54,23.62 R11.1 | 24.54,23.77 21.03,23.77 | 21.03,23.77 20.27,23.77 19.36,22.86 R2.2 16.31,22.86 14.63,21.18 14.63,20.57 IC2.20 14.63,20.42 14.63,19.36 v14.78,19.2 | 24.54,23.77 R11.1 | 21.03,23.77 v21.03,24.08 | v12.5,30.63 10.82,32.31 +5V.A | 38.86,15.24 38.86,17.68 S3-4.4 | 38.86,15.24 38.86,12.8 S1-2.4 38.86,12.65 38.86,10.21 S1-2.3 38.71,10.06 37.64,10.06 32.61,5.03 26.52,5.03 24.54,3.05 23.62,3.05 20.88,5.79 | 38.86,15.24 S3-4.3 | SV1.4 10.67,3.05 10.67,5.03 C5.2 10.82,5.18 20.27,5.18 20.88,5.79 | 20.88,5.79 20.88,7.77 19.81,8.84 19.36,8.84 DA1.3
  Bottom 0.152: 21.18,24.23 21.79,24.23 R1.2 | 21.18,24.23 18.75,26.67 18.44,26.67 C15.2 18.29,26.67 17.83,26.67 13.87,22.71 12.95,22.71 12.65,23.01 12.65,24.08 13.26,24.69 C6.1 13.41,24.84 17.22,28.65 18.9,28.65 20.12,27.43 22.4,27.43 C16.+ | v24.38,21.34 22.55,19.51 22.1,19.51 IC1.18 | v21.03,24.08 21.18,24.23 | IC1.4 13.41,17.07 12.95,17.07 12.5,17.53 12.5,18.14 12.95,18.59 13.41,18.59 IC1.6 13.56,18.75 14.02,18.75 14.48,19.2 | C14.2 18.29,30.33 17.98,30.63 v12.5,30.63 12.04,30.63 8.69,27.28 8.69,25.3 8.84,25.15 9.6,25.15 10.97,23.77 10.97,23.32 12.8,21.49 13.56,21.49 14.48,20.57 14.48,19.2 | 14.48,19.2 v14.78,19.2 16.61,17.37 16.61,16.76 14.48,14.63 14.48,14.02 10.97,10.52 10.97,3.35 SV1.4

### Text on the board
tNames: LOCO-Servo | 1
bNames: V2.0 | LOCO-Servo